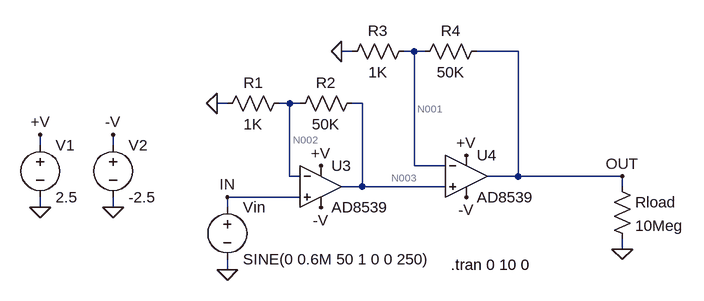
[diagram p0: schematic rogowski-coil-1.asc]
rogowski-coil-1.asc, the LTspice schematic file:
Version 4
SHEET 1 1240 700
WIRE 624 -1312 608 -1312
WIRE 720 -1312 704 -1312
WIRE 736 -1312 720 -1312
WIRE 880 -1312 816 -1312
WIRE 432 -1232 416 -1232
WIRE 528 -1232 512 -1232
WIRE 544 -1232 528 -1232
WIRE 640 -1232 624 -1232
WIRE 144 -1168 144 -1184
WIRE 256 -1168 256 -1184
WIRE 720 -1136 720 -1312
WIRE 768 -1136 720 -1136
WIRE 528 -1120 528 -1232
WIRE 544 -1120 528 -1120
WIRE 880 -1120 880 -1312
WIRE 880 -1120 832 -1120
WIRE 1040 -1120 880 -1120
WIRE 640 -1104 640 -1232
WIRE 640 -1104 608 -1104
WIRE 768 -1104 640 -1104
WIRE 1040 -1104 1040 -1120
WIRE 544 -1088 432 -1088
WIRE 144 -1072 144 -1088
WIRE 256 -1072 256 -1088
WIRE 432 -1072 432 -1088
WIRE 1040 -1008 1040 -1024
WIRE 432 -976 432 -992
FLAG 144 -1184 +V
FLAG 432 -976 0
FLAG 1040 -1120 OUT
FLAG 432 -1088 IN
FLAG 576 -1136 +V
FLAG 256 -1184 -V
FLAG 576 -1072 -V
FLAG 416 -1232 0
FLAG 1040 -1008 0
FLAG 256 -1072 0
FLAG 144 -1072 0
FLAG 608 -1312 0
FLAG 800 -1152 +V
FLAG 800 -1088 -V
SYMBOL voltage 144 -1184 R0
WINDOW 123 0 0 Left 2
WINDOW 39 0 0 Left 2
SYMATTR InstName V1
SYMATTR Value 2.5
SYMBOL voltage 432 -1088 R0
WINDOW 123 24 146 Left 2
WINDOW 39 24 125 Left 2
SYMATTR InstName Vin
SYMATTR Value SINE(0 0.6M 50 1 0 0 250)
SYMBOL res 528 -1248 R90
WINDOW 0 0 56 VBottom 2
WINDOW 3 32 56 VTop 2
SYMATTR InstName R1
SYMATTR Value 1K
SYMBOL res 640 -1248 R90
WINDOW 0 0 56 VBottom 2
WINDOW 3 32 56 VTop 2
SYMATTR InstName R2
SYMATTR Value 50K
SYMBOL voltage 256 -1184 R0
WINDOW 123 24 146 Left 2
WINDOW 39 24 125 Left 2
SYMATTR InstName V2
SYMATTR Value -2.5
SYMBOL res 1024 -1120 R0
SYMATTR InstName Rload
SYMATTR Value 10Meg
SYMBOL res 720 -1328 R90
WINDOW 0 0 56 VBottom 2
WINDOW 3 32 56 VTop 2
SYMATTR InstName R3
SYMATTR Value 1K
SYMBOL res 832 -1328 R90
WINDOW 0 0 56 VBottom 2
WINDOW 3 32 56 VTop 2
SYMATTR InstName R4
SYMATTR Value 50K
SYMBOL OpAmps\\AD8539 576 -1168 R0
SYMATTR InstName U3
SYMBOL OpAmps\\AD8539 800 -1184 R0
SYMATTR InstName U4
TEXT 776 -984 Left 2 !.tran 0 10 0

The netlist it stands for:
* rogowski-coil-1.asc
V1 +V 0 2.5
Vin IN 0 SINE(0 0.6M 50 1 0 0 250)
R1 N002 0 1K
R2 N003 N002 50K
V2 -V 0 -2.5
Rload OUT 0 10Meg
R3 N001 0 1K
R4 OUT N001 50K
XU3 IN N002 +V -V N003 AD8539  ; pins In+ In- V+ V- OUT
XU4 N003 N001 +V -V OUT AD8539  ; pins In+ In- V+ V- OUT
.tran 0 10 0
.backanno
.end

* Results of the author's LTspice run, read from the files saved beside the schematic
* Operating Point, zero values left out:
*   V(+v) = 2.5 V
*   V(n002) = 13.74 µV
*   V(n003) = 700.2 µV
*   V(-v) = -2.5 V
*   V(out) = 36.41 mV
*   V(n001) = 713.9 µV
*   I(R4) = 713.9 nA
*   I(R3) = 713.9 nA
*   I(Rload) = 3.641 nA
*   I(R2) = 13.73 nA
*   I(R1) = 13.74 nA
*   I(V2) = 289.9 µA
*   I(Vin) = -10 pA
*   I(V1) = -290.6 µA
*   Ix(u3:1) = 10 pA
*   Ix(u3:2) = -10 pA
*   Ix(u3:99) = 145.1 µA
*   Ix(u3:50) = -145.1 µA
*   Ix(u3:45) = -13.74 nA
*   Ix(u4:1) = 10 pA
*   Ix(u4:2) = -10 pA
*   Ix(u4:99) = 145.5 µA
*   Ix(u4:50) = -144.7 µA
*   Ix(u4:45) = -717.5 nA
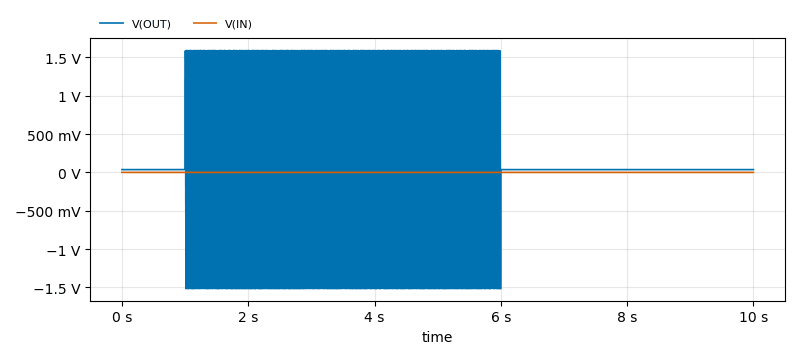
[diagram p1: Transient Analysis of rogowski-coil-1.asc, plotted from the saved traces]
* Transient Analysis, 1 run:
*   V(OUT): min -1.519 V, max 1.592 V, average 36.19 mV, rms 770.9 mV, last 36.41 mV
*   V(IN): min -599.8 µV, max 600 µV, average -31.66 nV, rms 300.9 µV, last 0 V